# Altium schematic sheet Sheet1.SchDoc
size A4
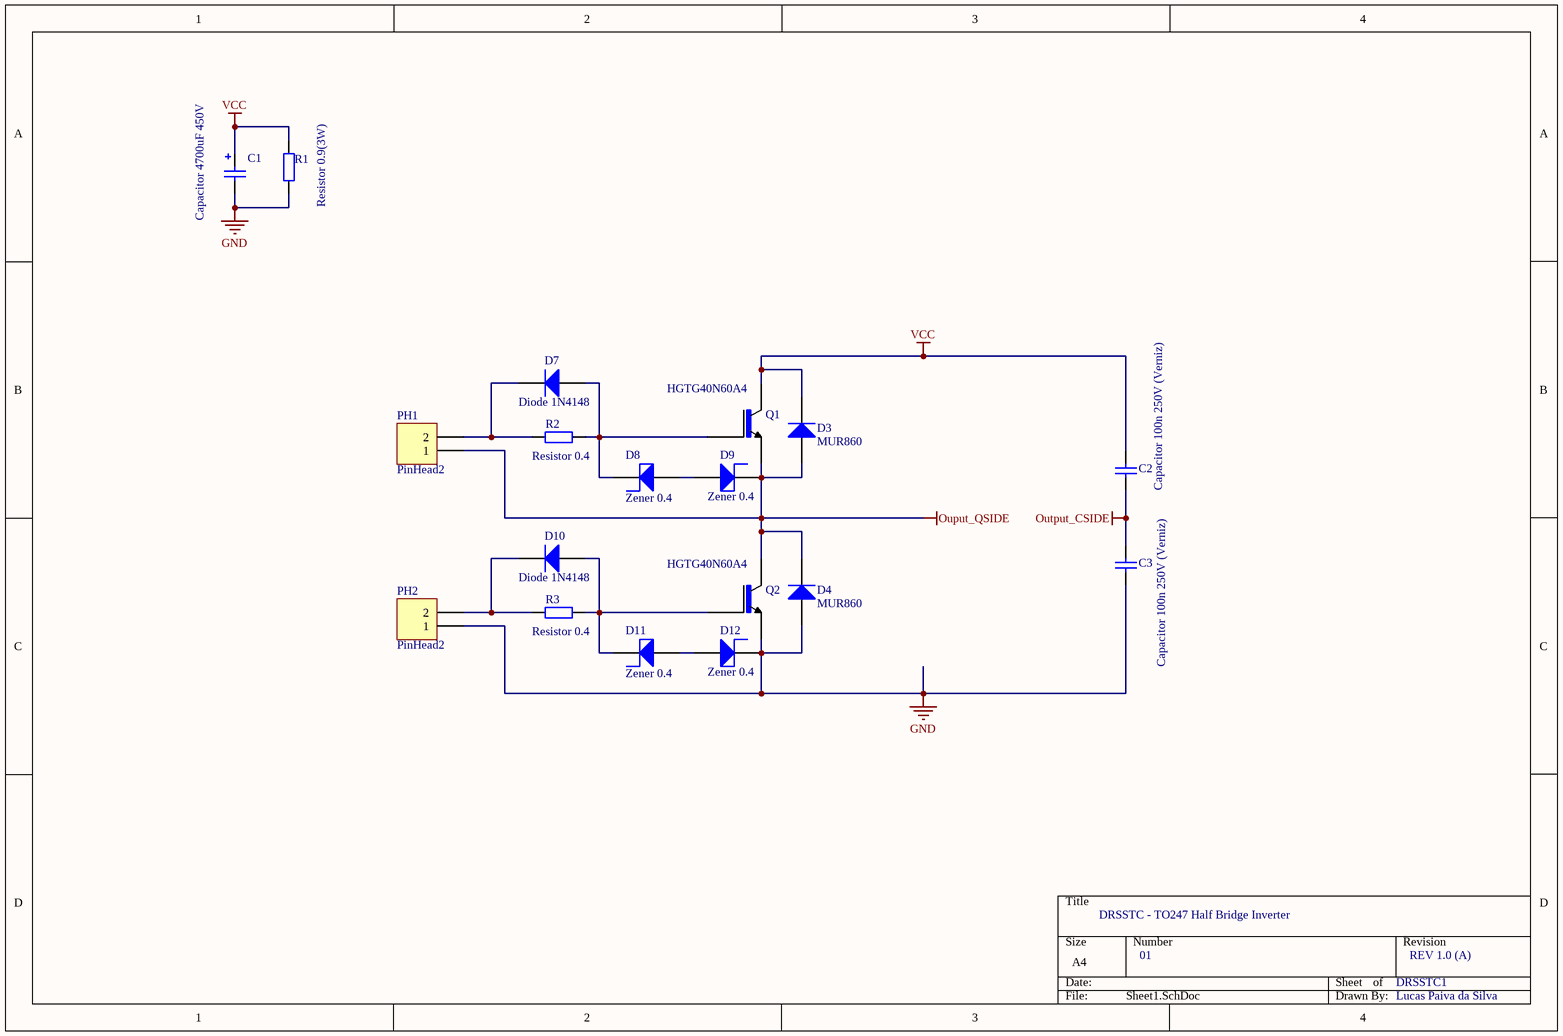
[diagram p0: Sheet1.SchDoc]

## Parts
C1  Capacitor 4700uF 450V  [Capacitor 4700uF 450V RIFA]
C2  Capacitor 100n 250V (Verniz)  [Capacitor 100n (cor verniz)]
C3  Capacitor 100n 250V (Verniz)  [Capacitor 100n (cor verniz)]
D3  MUR860  [MUR860]
D4  MUR860  [MUR860]
D7  Diode 1N4148  [Diode 8.89mm(350mils)]
D8  Zener 0.4  [Diode 0.4]
D9  Zener 0.4  [Diode 0.4]
D10  Diode 1N4148  [Diode 8.89mm(350mils)]
D11  Zener 0.4  [Diode 0.4]
D12  Zener 0.4  [Diode 0.4]
PH1  PinHead2  [PinHead2]
PH2  PinHead2  [PinHead2]
Q1  HGTG40N60A4  [HGTG40N60A4]
Q2  HGTG40N60A4  [HGTG40N60A4]
R1  Resistor 0.9(3W)  [Resistor Axial 0.9(3W)]
R2  Resistor 0.4  [Resistor Axial 0.4]
R3  Resistor 0.4  [Resistor Axial 0.4]

## Nets
GND: C1.1 C3.1 D4.3(A) D12.K PH2.1 Q2.3(E) R1.1
Ouput_QSIDE: D3.3(A) D4.1(K) D9.K PH1.1 Q1.3(E) Q2.2(C)
Output_CSIDE: C2.1 C3.2
VCC: C1.2 C2.2 D3.1(K) Q1.2(C) R1.2
NetD7_A: D7.A D8.K Q1.1(G) R2.2
NetD7_K: D7.K PH1.2 R2.1
NetD8_A: D8.A D9.A
NetD10_A: D10.A D11.K Q2.1(G) R3.2
NetD10_K: D10.K PH2.2 R3.1
NetD11_A: D11.A D12.A

## Notes on the sheet
- DRSSTC - TO247 Half Bridge Inverter
- 01
- DRSSTC1
- REV 1.0 (A)
- Lucas Paiva da Silva